# Altium schematic sheet 挂锁-151103.SCHDOC
size A4; PageSetup: Record=PageOptions|CenterHorizontal=True|CenterVertical=True|PrintScale=1.00|XCorrection=1.00|YCorrection=1.00|PrintKind=0|BorderSize=5000000|LeftOffset=0|BottomOffset=0|Orientation=2|PaperLength=1000|PaperWidth=1000|Scale=100|PaperSource=7|PrintQuality=-3|MediaType=1|DitherType=10|PrintScaleMode=1|PaperKind=A4|PaperIndex=9
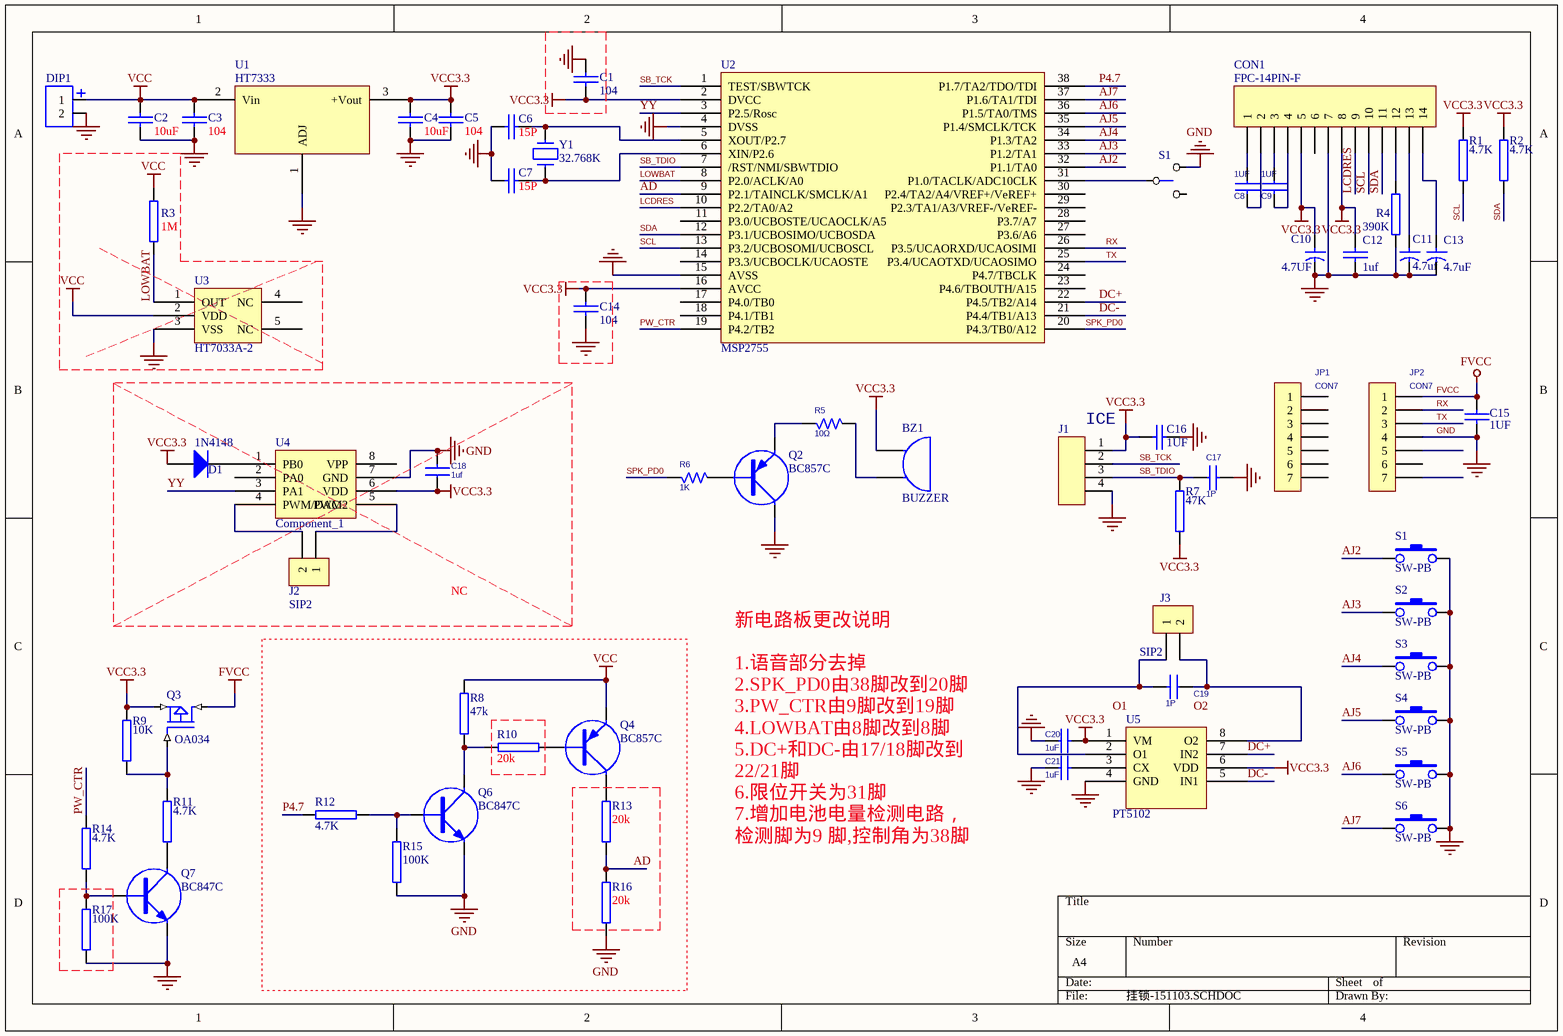
[diagram p0: 挂锁-151103.SCHDOC]

## Parts
(Parts that share a designator on the sheet are numbered #1, #2 ... from top to bottom, then left to right.)
BZ1  BUZZER  [2PAD-9]
C1  104  [0603C]
C2  10uF  [0805C]
C3  104  [0603C]
C4  10uF  [0805C]
C5  104  [0603C]
C6  15P  [0603C]
C7  15P  [0603C]
C8  1UF  [0603C]
C9  1UF  [0603C]
C10  4.7UF  [10U/16V SMT-A]
C11  4.7uf  [10U/16V SMT-A]
C12  1uf  [0603C]
C13  4.7uF  [10U/16V SMT-A]
C14  104  [0603C]
C15  1UF  [0603]
C16  1UF  [0603C]
C17  1P  [0603C]
C18  1uf  [0603]
C19  1P  [0603C]
C20  1uF  [0603C]
C21  1uF  [0603C]
CON1  FPC-14PIN-F  [OLED-SMD-14]
D1  1N4148  [0603]
DIP1  (no value)  [2PAD-9]
J1  4PIN  [PAD-1.27-4]  (value not drawn)
J2  SIP2  [2PAD-9]
J3  SIP2  [2PAD-9]
JP1  CON7  [PAD-1.27-7]
JP2  CON7  [PAD-1.27-7]
Q2  BC857C  [SOT-23]
Q3  OA034  [SOT-23-2]
Q4  BC857C  [SOT-23]
Q6  BC847C  [SOT-23]
Q7  BC847C  [SOT-23]
R1  4.7K  [0603R]
R2  4.7K  [0603R]
R3  1M  [0603R]
R4  390K  [0603R]
R5  10Ω  [0603R]
R6  1K  [0603R]
R7  47K  [0603R]
R8  47k  [0603R]
R9  10K  [0603R]
R10  20k  [0603R]
R11  4.7K  [0603R]
R12  4.7K  [0603R]
R13  20k  [0603R]
R14  4.7K  [0603R]
R15  100K  [0603R]
R16  20k  [0603R]
R17  100K  [0603R]
S1#1  SW-SPDT  [2PAD-9]  (value not drawn)
S1#2  SW-PB  [TS-030]
S2  SW-PB  [TS-030]
S3  SW-PB  [TS-030]
S4  SW-PB  [TS-030]
S5  SW-PB  [TS-030]
S6  SW-PB  [TS-030]
U1  HT7333  [SOT-89]
U2  MSP2755  [TSSOP-38]
U3  HT7033A-2  [SOT-23-5]
U4  Component_1
U5  PT5102  [MSOP-8]
Y1  32.768K  [CRYSTAL_3215]

## Blocks framed on the sheet
NC: C18 D1 J2 U4

## Nets
FVCC: C15.1 JP2.1 Q3.D
GND: C1.2 C2.2 C3.2 C4.2 C5.2 C6.2 C7.2 C10.2 C11.2 C12.2 C13.2 C14.2 C15.2 C16.2 C17.2 C18.2 C20.1 C21.1 CON1.7 DIP1.2 J1.4 JP2.4 Q2.C Q6.E Q7.E R4.1 R15.1 R16.1 R17.2 S1#1.2 S1#2.2 S2.2 S3.2 S4.2 S5.2 S6.2 U1.1(ADJ) U2.4(DVSS) U2.15(AVSS) U3.3(VSS) U4.7(GND) U5.4(GND)
VCC: C2.1 C3.1 DIP1.1 Q4.E R3.1 R8.2 U1.2(Vin) U3.2(VDD)
VCC3.3: BZ1.1(A) C1.1 C4.1 C5.1 C10.1 C12.1 C14.1 C16.1 C18.1 C20.2 CON1.5 CON1.8 D1.1(A) J1.1 Q3.S R1.2 R2.2 R7.1 R9.1 U1.3(+Vout) U2.2(DVCC) U2.16(AVCC) U4.6(VDD) U5.1(VM) U5.6(VDD)
AD: R13.1 R16.2 U2.9(P2.1/TAINCLK/SMCLK/A1)
AJ2: S1#2.1 U2.32(P1.1/TA0)
AJ3: S2.1 U2.33(P1.2/TA1)
AJ4: S3.1 U2.34(P1.3/TA2)
AJ5: S4.1 U2.35(P1.4/SMCLK/TCK)
AJ6: S5.1 U2.36(P1.5/TA0/TMS)
AJ7: S6.1 U2.37(P1.6/TA1/TDI)
DC+: U2.22(P4.5/TB2/A14) U5.7(IN2)
DC-: U2.21(P4.4/TB1/A13) U5.5(IN1)
LCDRES: CON1.9 U2.10(P2.2/TA0/A2)
LOWBAT: R3.2 U2.8(P2.0/ACLK/A0) U3.1(OUT)
P4.7: R12.2 U2.38(P1.7/TA2/TDO/TDI)
PW_CTR: R14.1 U2.19(P4.2/TB2)
RX: JP2.2 U2.26(P3.5/UCAORXD/UCAOSIMI)
SB_TCK: J1.2 U2.1(TEST/SBWTCK)
SB_TDIO: C17.1 J1.3 R7.2 U2.7(/RST/NMI/SBWTDIO)
SCL: CON1.10 R1.1 U2.13(P3.2/UCBOSOMI/UCBOSCL)
SDA: CON1.11 R2.1 U2.12(P3.1/UCBOSIMO/UCBOSDA)
SPK_PD0: R6.1 U2.20(P4.3/TB0/A12)
TX: JP2.3 U2.25(P3.4/UCAOTXD/UCAOSIMO)
YY: U2.3(P2.5/Rosc) U4.3(PA1)
NetBZ1_2: BZ1.2(B) R5.2
NetC6_1: C6.1 U2.5(XOUT/P2.7) Y1.2
NetC7_1: C7.1 U2.6(XIN/P2.6) Y1.1
NetC8_1: C8.1 CON1.1
NetC8_2: C8.2 CON1.2
NetC9_1: C9.1 CON1.3
NetC9_2: C9.2 CON1.4
NetC11_1: C11.1 CON1.13
NetC13_1: C13.1 CON1.14
NetC19_1: C19.1 J3.2 U5.8(O2)
NetC19_2: C19.2 J3.1 U5.2(O1)
NetC21_2: C21.2 U5.3(CX)
NetCON1_12: CON1.12 R4.2
NetD1_2: D1.2(K) U4.1(PB0)
NetJ2_1: J2.1 U4.5(PWM2)
NetJ2_2: J2.2 U4.4(PWM/DAC)
NetQ2_B: Q2.B R6.2
NetQ2_E: Q2.E R5.1
NetQ3_G: Q3.G R9.2 R11.1
NetQ4_B: Q4.B R10.2
NetQ4_C: Q4.C R13.2
NetQ6_B: Q6.B R12.1 R15.2
NetQ6_C: Q6.C R8.1 R10.1
NetQ7_B: Q7.B R14.2 R17.1
NetQ7_C: Q7.C R11.2
NetS1#1_1: S1#1.1 U2.31(P1.0/TACLK/ADC10CLK)

Not connected (* = marked no-connect by the designer): CON1 6; JP1 1 2 3 4 5 6 7; JP2 5 6 7; S1#1 3; U2 11(P3.0/UCBOSTE/UCAOCLK/A5) 14(P3.3/UCBOCLK/UCAOSTE) 17(P4.0/TB0) 18(P4.1/TB1) 23(P4.6/TBOUTH/A15) 24(P4.7/TBCLK) 27(P3.6/A6) 28(P3.7/A7) 29(P2.3/TA1/A3/VREF-/VeREF-) 30(P2.4/TA2/A4/VREF+/VeREF+); U3 4(NC) 5(NC); U4 2(PA0) 8(VPP)

## Notes on the sheet
- (near J1) ICE
- 新电路板更改说明
  1.语音部分去掉
  2.SPK_PD0由38脚改到20脚
  3.PW_CTR由9脚改到19脚
  4.LOWBAT由8脚改到8脚
  5.DC+和DC-由17/18脚改到22/21脚
  6.限位开关为31脚
  7.增加电池电量检测电路，检测脚为9 脚,控制角为38脚
- Labels drawn without touching a wire or pin: O1, O2

## Library data of the parts
C1-C7 C12 C14-C16 = CAP: Capacitor
C8 C9 C17-C21 = CAP NP_Dup3: Right: 20; Bottom: 10
C10 C11 C13 = CAP_E: 1206
CON1 = CON14: Connector
D1 = Diode 1N4148: High Conductance Fast Diode; Published: 8-Jun-2000; LatestRevisionDate: 17-Jul-2002; LatestRevisionNote: Re-released for DXP Platform.; DatasheetDocument: 1997; PackageReference: DO-35; Publisher: Altium Limited; Code_JEDEC: DO-204-AH; ComponentLink1Description: Manufacturer Link; ComponentLink1URL: http://www.fairchildsemi.com/; ComponentLink2Description: Datasheet; ComponentLink2URL: http://www.fairchildsemi.com/ds/1N%2F1N4148.pdf
DIP1 = DIP2
J2 J3 = CON2: Connector
JP1 JP2 = CON7: Connector
Q2 Q4 = PNP: PNP Transistor
Q3 = MOSFET P
Q6 Q7 = NPN: NPN Transistor
R1 R2 R4 R7-R17 = RES
R3 = res
R5 R6 = R_Dup3: PSpiceTemplate: R^@REFDES %1 %2 ?TOLERANCE|R^@REFDES| @VALUE  ?TOLERANCE|\n.model R^@REFDES RES R=1 DEV=@TOLERANCE%|; Right: 20; Bottom: 20
U1 = LM117K
U2 U5 = Component_1
Y1 = CRYSTAL